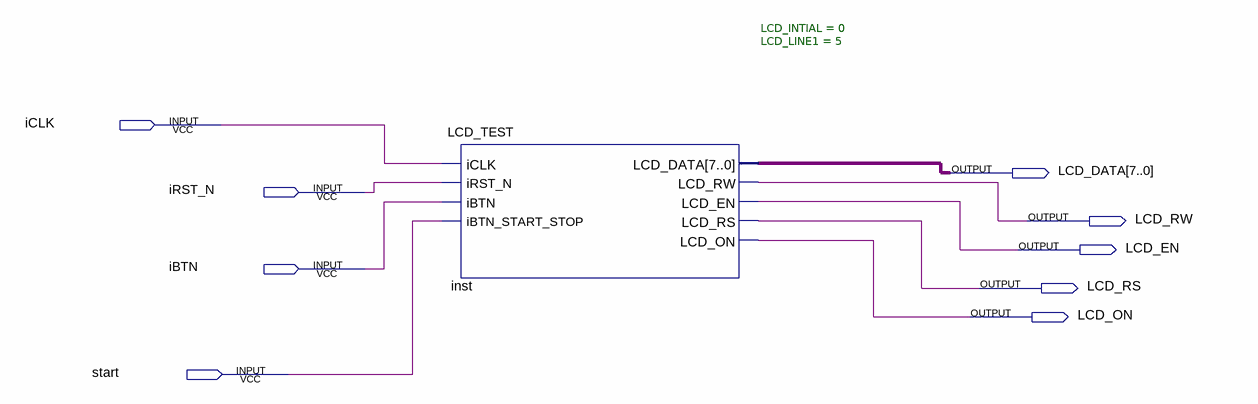
[diagram p0: schematic sheet]
// Quartus schematic Block1.bdf as structural Verilog: 1 symbols, 9 pins
module Block1 (
  input  iCLK,
  input  iRST_N,
  input  iBTN,
  input  start,
  output [7:0] LCD_DATA,
  output LCD_RW,
  output LCD_EN,
  output LCD_RS,
  output LCD_ON
);

  LCD_TEST #(.LCD_INTIAL(0), .LCD_LINE1(5)) inst (
    .iCLK(iCLK), .iRST_N(iRST_N), .iBTN(iBTN), .iBTN_START_STOP(start), .LCD_DATA(LCD_DATA), .LCD_RW(LCD_RW),
    .LCD_EN(LCD_EN), .LCD_RS(LCD_RS), .LCD_ON(LCD_ON));
endmodule
